# EAGLE design RoverMux (EAGLE 6.4)
DATABASE: /home/mes/eagle/PARTSDB.txt
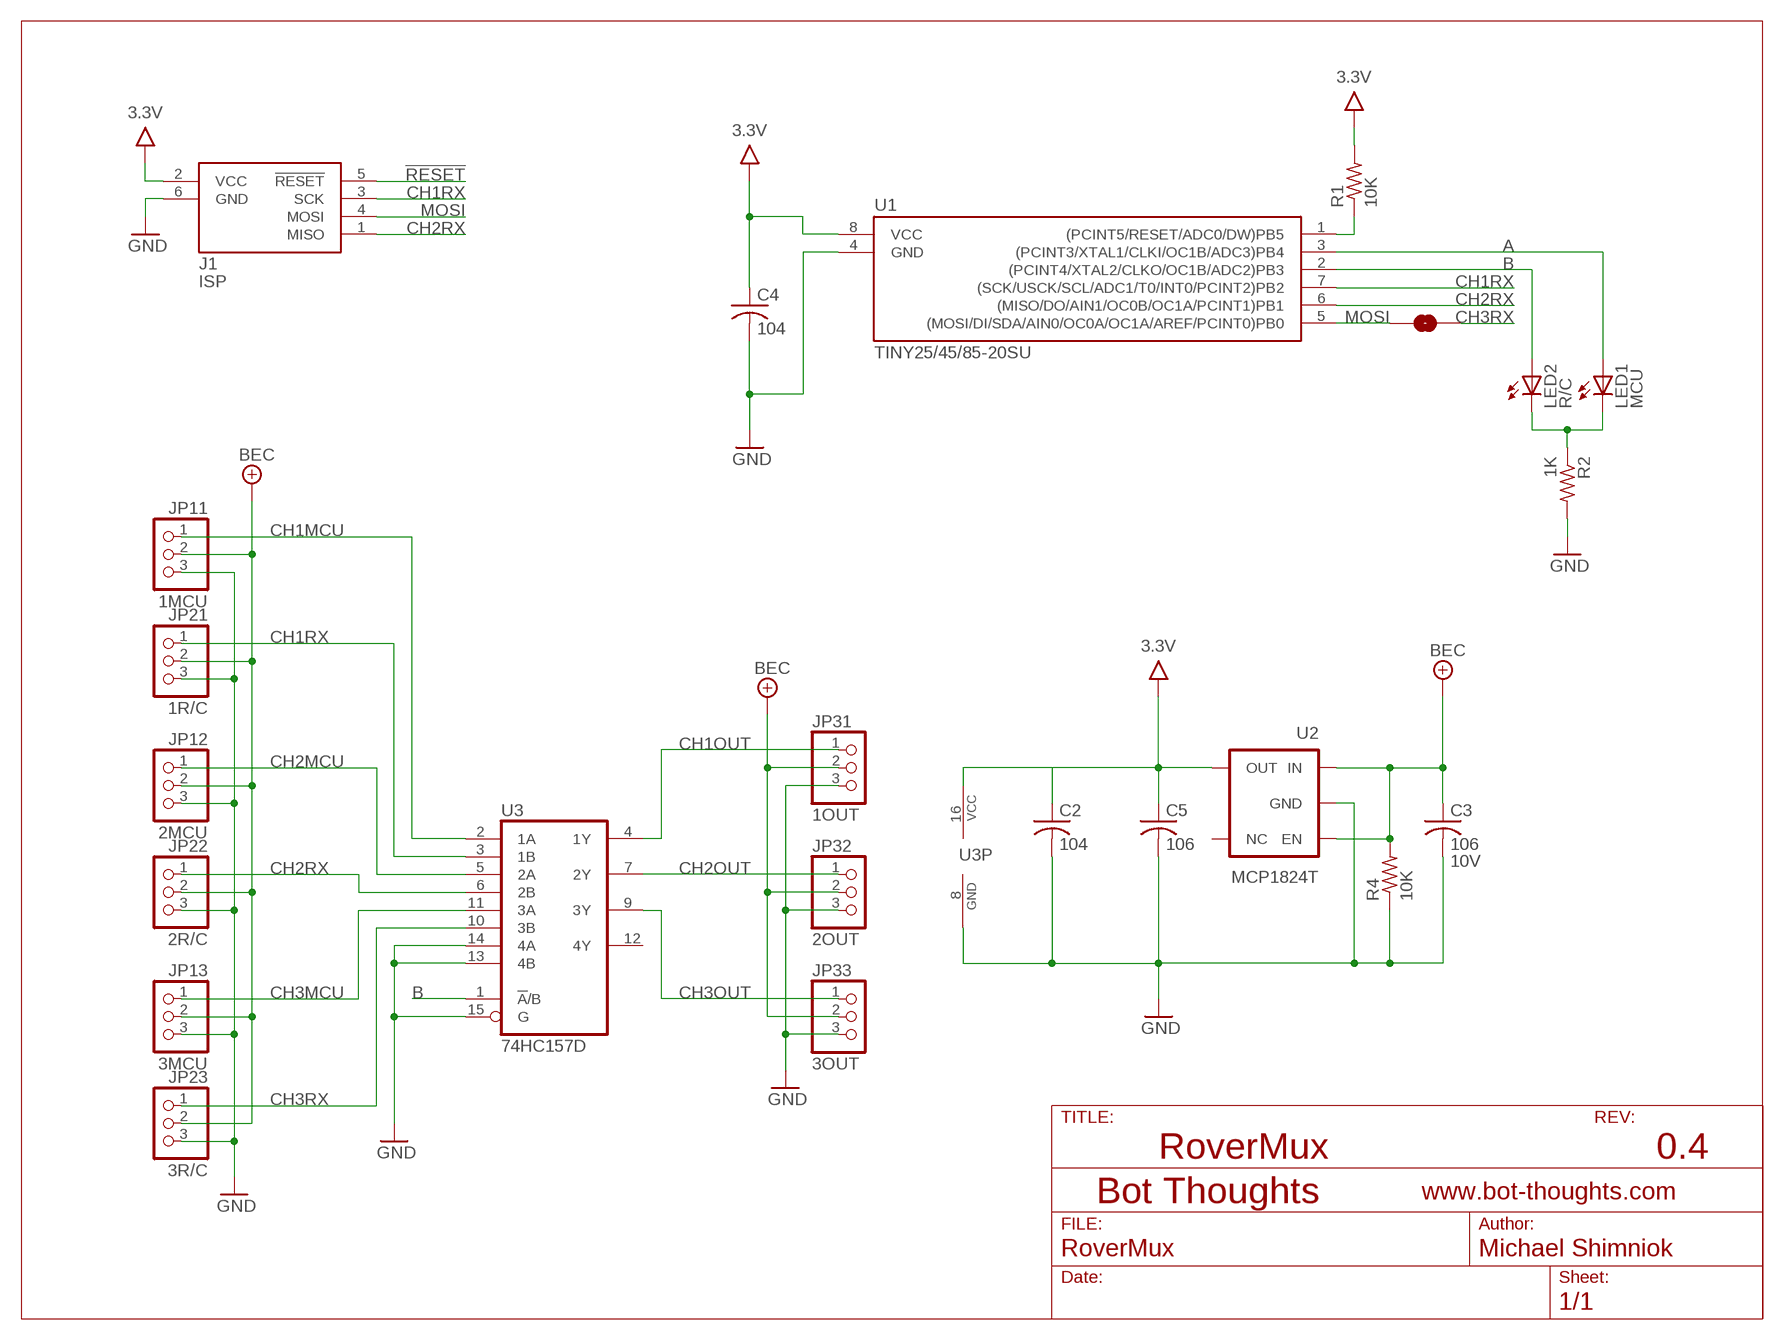
[diagram p0: schematic, sheet 1]

## Parts
C2  104  C-USC0603  [C0603]
C3  106  C-USC0603  [C0603]
C4  104  C-USC0603  [C0603]
C5  106  C-USC0603  [C0603]
J1  ISP  AVRISP6  [CON6P2R]
JP11  1MCU  PINHD-1X03_2.54-S  [1X03-S]
JP12  2MCU  PINHD-1X03_2.54-S  [1X03-S]
JP13  3MCU  PINHD-1X03_2.54-S  [1X03-S]
JP21  1R/C  PINHD-1X03_2.54-S  [1X03-S]
JP22  2R/C  PINHD-1X03_2.54-S  [1X03-S]
JP23  3R/C  PINHD-1X03_2.54-S  [1X03-S]
JP31  1OUT  PINHD-1X03_2.54-S  [1X03-S]
JP32  2OUT  PINHD-1X03_2.54-S  [1X03-S]
JP33  3OUT  PINHD-1X03_2.54-S  [1X03-S]
LED1  MCU  LEDCHIPLED_1206  [CHIPLED_1206]
LED2  R/C  LEDCHIPLED_1206  [CHIPLED_1206]
R1  10K  R-US_R0603  [R0603]
R2  1K  R-US_R0603  [R0603]
R4  10K  R-US_R0603  [R0603]
SJ1  CH3  SOLDERJUMPERNC2  [SJ_2S-NOTRACE]
U1  TINY25/45/85-20SU  [SOIC8]
U2  MCP1824T  MCP1801  [SOT23-5]
U3  74HC157D  74LS157D  [SO16]

## Nets
3.3V: C2.1 C4.1 C5.1 J1.2(VCC) R1.2 U1.8(VCC) U2.5(OUT) U3.16(VCC)
!RESET: J1.5(!RESET) R1.1 U1.1((PCINT5/RESET/ADC0/DW)PB5)
A: LED1.A U1.3((PCINT3/XTAL1/CLKI/OC1B/ADC3)PB4)
B: LED2.A U1.2((PCINT4/XTAL2/CLKO/OC1B/ADC2)PB3) U3.1(!A!/B)
BEC: C3.1 JP11.2 JP12.2 JP13.2 JP21.2 JP22.2 JP23.2 JP31.2 JP32.2 JP33.2 R4.2 U2.1(IN) U2.3(EN)
CH1MCU: JP11.1 U3.2(1A)
CH1OUT: JP31.1 U3.4(1Y)
CH1RX: J1.3(SCK) JP21.1 U1.7((SCK/USCK/SCL/ADC1/T0/INT0/PCINT2)PB2) U3.3(1B)
CH2MCU: JP12.1 U3.5(2A)
CH2OUT: JP32.1 U3.7(2Y)
CH2RX: J1.1(MISO) JP22.1 U1.6((MISO/DO/AIN1/OC0B/OC1A/PCINT1)PB1) U3.6(2B)
CH3MCU: JP13.1 U3.11(3A)
CH3OUT: JP33.1 U3.9(3Y)
CH3RX: JP23.1 SJ1.2 U3.10(3B)
GND: C2.2 C3.2 C4.2 C5.2 J1.6(GND) JP11.3 JP12.3 JP13.3 JP21.3 JP22.3 JP23.3 JP31.3 JP32.3 JP33.3 R2.2 R4.1 U1.4(GND) U2.2(GND) U3.8(GND) U3.13(4B) U3.14(4A) U3.15(G)
MOSI: J1.4(MOSI) SJ1.1 U1.5((MOSI/DI/SDA/AIN0/OC0A/OC1A/AREF/PCINT0)PB0)
N$3: LED1.C LED2.C R2.1
Unconnected: U2.4(NC) U3.12(4Y)

## Notes on the sheet
- RoverMux | 0.4

## Library data of the parts
C2 C4 = rcl:C-US: CAPACITOR, American symbol; PARTNO: C1608X7R1E104K080AA
C3 = rcl:C-US: CAPACITOR, American symbol; PARTNO: CL10A106MP8NNNC; VOLTAGE: 10V
C5 = rcl:C-US: CAPACITOR, American symbol; PARTNO: CL10A106MP8NNNC
J1 = bt_avr:AVRISP6: 6-pin dual-row connector for Atmel AVRISP programmer interface
JP11-JP13 JP21-JP23 JP31-JP33 = pinhead-2:PINHD-1X03: PIN HEADER
LED1 = led:LED: LED OSRAM: - CHIPLED LG R971, LG N971, LY N971, LG Q971, LY Q971, LO R971, LY R971 LH N974, LH R974 LS Q976, LO Q976, LY Q976 LO Q996 - Hyper CHIPLED LW Q18S LB Q993, LB Q99A, LB R99A - SideLED LS A670, LO A670, LY A670, LG A670, LP A670 LB A673, LV A673, LT A673, LW A673 LH A674 LY A675 LS A676, LA A676, LO A676, LY A676, LW A676 LS A679, LY A679, LG A679 - Hyper Micro SIDELED® LS Y876, LA Y876, LO Y876, LY Y876 LT Y87S - SmartLED LW L88C, LW L88S LB L89C, LB L89S, LG L890 LS L89K, LO L89K, LY L89K LS L896, LA L896, LO L896, LY L896 - TOPLED LS T670, LO T670, LY T670, LG T670, LP T670 LSG T670, LSP T670, LSY T670, LOP T670, LYG T670 LG T671, LOG T671, LSG T671 LB T673, LV T673, LT T673, LW T673 LH T674 LS T676, LA T676, LO T676, LY T676, LB T676, LH T676, LSB T676, LW T676 LB T67C, LV T67C, LT T67C, LS T67K, LO T67K, LY T67K, LW E67C LS E67B, LA E67B, LO E67B, LY E67B, LB E67C, LV E67C, LT E67C LW T67C LS T679, LY T679, LG T679 LS T770, LO T770, LY T770, LG T770, LP T770 LB T773, LV T773, LT T773, LW T773 LH T774 LS E675, LA E675, LY E675, LS T675 LS T776, LA T776, LO T776, LY T776, LB T776 LHGB T686 LT T68C, LB T68C - Hyper Mini TOPLED® LB M676 - Mini TOPLED Santana® LG M470 LS M47K, LO M47K, LY M47K Source: http://www.osram.convergy.de LUXEON: - LUMILED® LXK2-PW12-R00, LXK2-PW12-S00, LXK2-PW14-U00, LXK2-PW14-V00 LXK2-PM12-R00, LXK2-PM12-S00, LXK2-PM14-U00 LXK2-PE12-Q00, LXK2-PE12-R00, LXK2-PE12-S00, LXK2-PE14-T00, LXK2-PE14-U00 LXK2-PB12-K00, LXK2-PB12-L00, LXK2-PB12-M00, LXK2-PB14-N00, LXK2-PB14-P00, LXK2-PB14-Q00 LXK2-PR12-L00, LXK2-PR12-M00, LXK2-PR14-Q00, LXK2-PR14-R00 LXK2-PD12-Q00, LXK2-PD12-R00, LXK2-PD12-S00 LXK2-PH12-R00, LXK2-PH12-S00 LXK2-PL12-P00, LXK2-PL12-Q00, LXK2-PL12-R00 Source: www.luxeon.com KINGBRIGHT: KA-3528ASYC Source: www.kingbright.com; PARTNO: LH N974-KN-1
LED2 = led:LED: LED OSRAM: - CHIPLED LG R971, LG N971, LY N971, LG Q971, LY Q971, LO R971, LY R971 LH N974, LH R974 LS Q976, LO Q976, LY Q976 LO Q996 - Hyper CHIPLED LW Q18S LB Q993, LB Q99A, LB R99A - SideLED LS A670, LO A670, LY A670, LG A670, LP A670 LB A673, LV A673, LT A673, LW A673 LH A674 LY A675 LS A676, LA A676, LO A676, LY A676, LW A676 LS A679, LY A679, LG A679 - Hyper Micro SIDELED® LS Y876, LA Y876, LO Y876, LY Y876 LT Y87S - SmartLED LW L88C, LW L88S LB L89C, LB L89S, LG L890 LS L89K, LO L89K, LY L89K LS L896, LA L896, LO L896, LY L896 - TOPLED LS T670, LO T670, LY T670, LG T670, LP T670 LSG T670, LSP T670, LSY T670, LOP T670, LYG T670 LG T671, LOG T671, LSG T671 LB T673, LV T673, LT T673, LW T673 LH T674 LS T676, LA T676, LO T676, LY T676, LB T676, LH T676, LSB T676, LW T676 LB T67C, LV T67C, LT T67C, LS T67K, LO T67K, LY T67K, LW E67C LS E67B, LA E67B, LO E67B, LY E67B, LB E67C, LV E67C, LT E67C LW T67C LS T679, LY T679, LG T679 LS T770, LO T770, LY T770, LG T770, LP T770 LB T773, LV T773, LT T773, LW T773 LH T774 LS E675, LA E675, LY E675, LS T675 LS T776, LA T776, LO T776, LY T776, LB T776 LHGB T686 LT T68C, LB T68C - Hyper Mini TOPLED® LB M676 - Mini TOPLED Santana® LG M470 LS M47K, LO M47K, LY M47K Source: http://www.osram.convergy.de LUXEON: - LUMILED® LXK2-PW12-R00, LXK2-PW12-S00, LXK2-PW14-U00, LXK2-PW14-V00 LXK2-PM12-R00, LXK2-PM12-S00, LXK2-PM14-U00 LXK2-PE12-Q00, LXK2-PE12-R00, LXK2-PE12-S00, LXK2-PE14-T00, LXK2-PE14-U00 LXK2-PB12-K00, LXK2-PB12-L00, LXK2-PB12-M00, LXK2-PB14-N00, LXK2-PB14-P00, LXK2-PB14-Q00 LXK2-PR12-L00, LXK2-PR12-M00, LXK2-PR14-Q00, LXK2-PR14-R00 LXK2-PD12-Q00, LXK2-PD12-R00, LXK2-PD12-S00 LXK2-PH12-R00, LXK2-PH12-S00 LXK2-PL12-P00, LXK2-PL12-Q00, LXK2-PL12-R00 Source: www.luxeon.com KINGBRIGHT: KA-3528ASYC Source: www.kingbright.com; PARTNO: LG N971-KN-1
R1 R4 = rcl:R-US_: RESISTOR, American symbol; PARTNO: 1622829-1
R2 = rcl:R-US_: RESISTOR, American symbol; PARTNO: RC0603JR-07330RL
SJ1 = SparkFun:SOLDERJUMPER: Solder Jumper Standard SMD solder jumper. Used to automate production. Two varients : Normally Open and Normally Closed are the same, but have different paste layers. NC will have a large amount of paste and should jumper during reflow.
U1 = bt_avr:TINY25/45/85: Atmel AVR ATiny25,45,85 8-bit Microcontroller
U2 = mes_regulators:MCP1801: Microchip MCP1801 LDO Regulator The MCP1801 is a family of CMOS low dropout (LDO) voltage regulators that can deliver up to 150 mA of current while consuming only 25 μA of quiescent current (typical) with input operating range from 2.0V to 10.0V. Datasheet.pdf <http://ww1.microchip.com/downloads/en/DeviceDoc/22051D.pdf>; PARTNO: MCP1824T-5002E/OT
U3 = 74xx-us:74*157: Quadruple 2-line to 1-line data SELECTOR/MULTIPLEXER; PARTNO: 74HCT157D,652

## Board
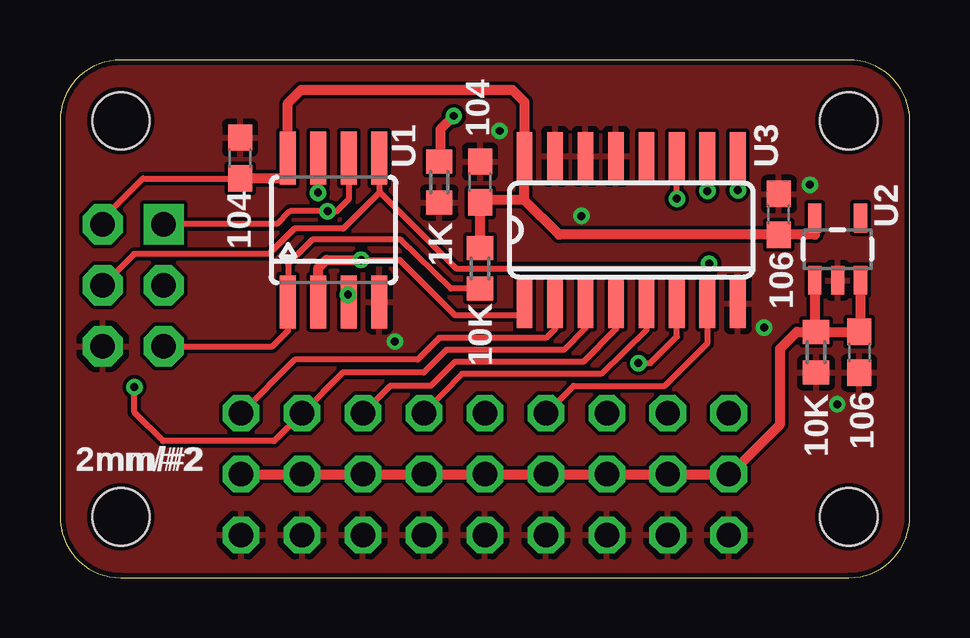
[diagram p1: board, top side]
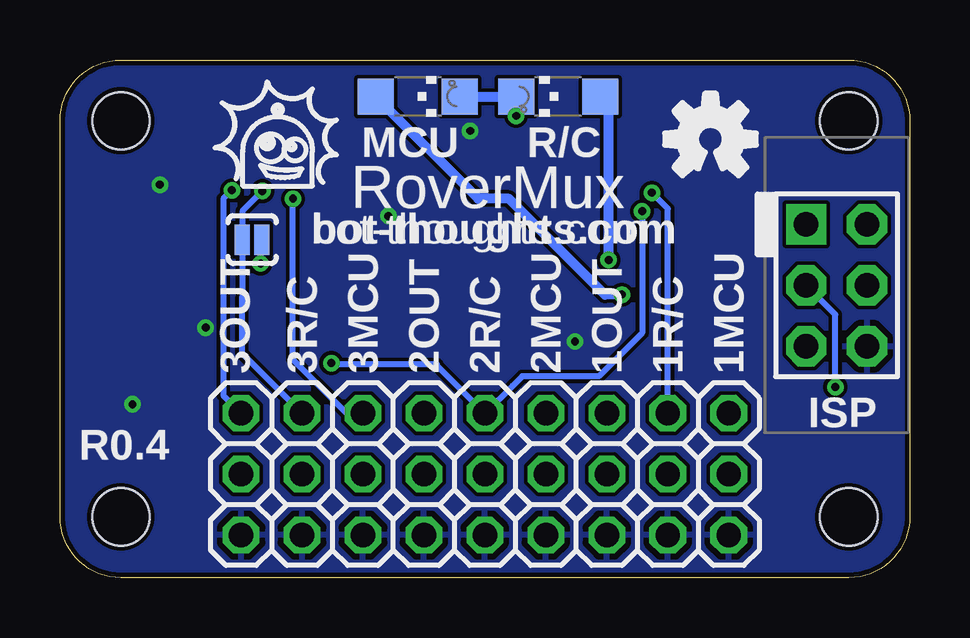
[diagram p2: board, bottom side, seen from below]

Size 35.41 x 21.59 mm. Coordinates in mm from the lower left corner, seen from the top.
Outline: 32.87,21.59 2.54,21.59 arc90 0,19.05 0,2.54 arc90 2.54,0 32.87,0 arc90 35.41,2.54 35.41,19.05 arc90 32.87,21.59
Copper layers (1*16): Top 0.0356mm / dielectric 1.5011mm / Bottom 0.0356mm
Design rules "LaenPCBOrder *": minimum track width 6mil, minimum drill 13mil, track to track 6mil, track to pad 6mil, pad to pad 6mil, via to via 6mil, smd to smd 6mil, copper to edge 8mil, drill to drill 6mil, minimum pad ring 7mil, minimum via ring 7mil, stop-mask expansion 4mil, vias tented up to drill 20mil, thermal gap 10mil
Holes 2.39 mm at 32.87,2.54 32.87,19.05 2.54,2.54 2.54,19.05

### Footprints (pad centres in the part's own frame; a part is rotated, then mirrored left to right if it is on the bottom)
C0603 = smd 1.1 x 1: 1 -0.85,0; 2 0.85,0
CON6P2R = drill 1.016 pad 1.676 square: 1 -2.54,-1.27 | drill 1.016 pad 1.676 octagon: 2 -2.54,1.27; 3 0,-1.27; 4 0,1.27; 5 2.54,-1.27; 6 2.54,1.27
1X03-S = drill 1.016 octagon: 1 -2.54,0; 2 0,0; 3 2.54,0
CHIPLED_1206 = smd 1.5 x 1.5: A 0,-1.75; C 0,1.75
R0603 = smd 1 x 1.1: 1 -0.85,0; 2 0.85,0
SJ_2S-NOTRACE = smd 0.635 x 1.27: 1 -0.401,0; 2 0.413,0
SOIC8 = smd 0.66 x 2.2: 1 -1.905,-3; 2 -0.635,-3; 3 0.635,-3; 4 1.905,-3; 5 1.905,3; 6 0.635,3; 7 -0.635,3; 8 -1.905,3
SOT23-5 = smd 0.55 x 1.2: 1 -0.95,-1.3; 2 0,-1.3; 3 0.95,-1.3; 4 0.95,1.3; 5 -0.95,1.3
SO16 = smd 0.66 x 2.032: 1 -4.445,-3.073; 2 -3.175,-3.073; 3 -1.905,-3.073; 4 -0.635,-3.073; 5 0.635,-3.073; 6 1.905,-3.073; 7 3.175,-3.073; 8 4.445,-3.073; 9 4.445,3.073; 10 3.175,3.073; 11 1.905,3.073; 12 0.635,3.073; 13 -0.635,3.073; 14 -1.905,3.073; 15 -3.175,3.073; 16 -4.445,3.073

### Placement (x,y rotation side)
C2  17.5,16.5 90 top
C3  33.3,9.4 270 top
C4  7.5,17.5 90 top
C5  29.95,15.15 90 top
J1  3.05,12.19 270 bottom
JP11  7.54,4.32 270 bottom
JP12  15.16,4.32 270 bottom
JP13  22.78,4.32 270 bottom
JP21  10.08,4.32 270 bottom
JP22  17.7,4.32 270 bottom
JP23  25.32,4.32 270 bottom
JP31  12.62,4.32 270 bottom
JP32  20.24,4.32 270 bottom
JP33  27.86,4.32 270 bottom
LED1  20.5,20.07 270 bottom
LED2  14.66,20.07 90 bottom
R1  17.5,12.9 90 top
R2  15.8,16.5 270 top
R4  31.5,9.4 90 top
SJ1  27.4,14.1 180 bottom
U1  11.4,14.5 0 top
U2  32.4,13.7 0 top
U3  23.8,14.5 0 top

### Tracks (layer width: path | path; a pad name or v marks a point on that pad's centre or on a via)
3.3V
  Top 0.254: J1.2 1.78,14.98 3.45,16.65 C4.1
  Top 0.406: U2.5 31.45,14.3 C5.1 20.8,14.3 19.35,15.75 | 19.35,15.75 19.35,17.15 19.36,16.86 U3.16 19.35,19.85 18.85,20.35 10.05,20.35 9.49,19.8 U1.8 9.49,16.7 9.4,16.65 C4.1 | 19.35,15.75 17.8,15.75 C2.1 R1.2
!RESET
  Top 0.254: J1.5 8.85,9.65 9.5,10.3 U1.1 9.5,13.1 10.5,14.1 14.2,14.1 16.3,12.05 R1.1
A  (via drill 0.33)
  Top 0.254: U1.3 12.04,11.79 v12,11.8
  Bottom 0.406: v12,11.8 12.7,11.8 16.7,15.8 17.98,15.8 LED1.A
B  (via drill 0.33)
  Top 0.254: v12.55,13.25 14.15,13.25 16.45,10.95 19.25,10.95 19.3,10.9 19.3,11.37 U3.1
  Top 0.406: U1.2 10.77,12.91 11.1,13.25 v12.55,13.25
  Bottom 0.406: v12.55,13.25 12.55,19.71 LED2.A
BEC
  Top 0.254: 31.27,10.18 R4.2 | 33.17,10.18 C3.1
  Top 0.406: R4.2 C3.1 33.35,10.4 U2.3 | U2.1 31.45,10.5 R4.2 | JP11.2 JP21.2 JP31.2 JP12.2 JP22.2 JP32.2 JP13.2 JP23.2 JP33.2 27.92,4.32 30,6.4 30,9.55 30.7,10.25 R4.2
CH1MCU
  Top 0.254: U3.2 20.62,10.38 20.25,10 15.8,10 14.9,9.1 9.79,9.1 JP11.1
CH1OUT
  Top 0.254: U3.4 23.16,10.37 21.8,9 16.45,9 15.45,8 13.77,8 JP31.1
CH1RX  (via drill 0.33)
  Top 0.254: v3.1,7.95 3.1,6.9 4.3,5.7 8.93,5.7 JP21.1 11.78,8.55 15.15,8.55 16.1,9.5 21,9.5 21.89,10.39 U3.3 | U1.7 10.77,16.07 v10.75,16.05
  Bottom 0.254: v3.1,7.95 3.1,10.97 J1.3 | JP21.1 10.08,15.38 v10.75,16.05
CH2MCU
  Top 0.254: U3.5 24.43,10.34 22.55,8.5 16.76,8.5 JP12.1
CH2OUT
  Top 0.254: JP32.1 20.26,6.86 21.4,8 25.2,8 26.98,9.78 U3.7
CH2RX  (via drill 0.33)
  Top 0.254: v24.1,8.95 24.6,8.95 25.7,10.05 25.7,11.4 U3.6 | U1.6 12.05,17.48 12.05,15.8 11.53,15.28 v11.15,15.28 9.58,15.28 9.05,14.75 4.34,14.75 J1.1
  Bottom 0.254: 19.75,8.9 JP22.1 16.55,8 16.15,8.4 12.95,8.4 11.15,10.2 v11.15,15.28 | 19.75,8.9 24.05,8.9 v24.1,8.95 | 19.75,8.9 19.7,8.9
CH3MCU  (via drill 0.33)
  Top 0.254: v25.7,15.8 25.7,17.55 U3.11
  Bottom 0.254: JP13.1 23.46,6.86 25.7,9.1 v25.7,15.8
CH3OUT  (via drill 0.33)
  Top 0.254: U3.9 v28.25,16.16
  Bottom 0.254: v28.25,16.16 28.6,15.8 28.6,7.59 JP33.1
CH3RX  (via drill 0.33)
  Top 0.254: U3.10 v26.98,16.12
  Bottom 0.254: JP23.1 27.83,9.36 SJ1.2 27.81,15.29 v26.98,16.12
GND  (via drill 0.33)
  other vias: 31.25,16.38 32.39,7.23 21.72,15.08 29.34,10.43 13.95,9.85 18.32,18.63
  pour Top (rank 3): 2.54,21.59 32.87,21.59 arc-90 35.41,19.05 35.41,2.54 arc-90 32.87,0 2.54,0 arc-90 0,2.54 0,19.05 arc-90
  pour Bottom: 2.54,21.59 32.87,21.59 arc-90 35.41,19.05 35.41,2.54 arc-90 32.87,0 2.54,0 arc-90 0,2.54 0,19.05 arc-90
MOSI  (via drill 0.33)
  Top 0.254: U1.5 13.3,16.09 | 13.3,16.09 16.5,12.9 26.85,12.9 v27.05,13.1 | 13.3,16.09 13.3,16.05 11.8,14.55 9.75,14.55 8.7,13.5 3.09,13.5 J1.4
  Bottom 0.254: v27.05,13.1 27.05,14.05 SJ1.1
N$3  (via drill 0.33)
  Top 0.406: v16.41,19.26 15.85,18.7 15.85,17.4 R2.1
  Bottom 0.406: LED1.C LED2.C v16.41,19.26

### Text on the board
tPlace: 2mm/#2
bNames: RoverMux | bot-thoughts.com | R0.4
tsilk: U1 | U3 | 104 | 104 | 1K | U2 | 106 | 10K | 10K | 106 | 2mm/#2
bsilk: R/C | MCU | RoverMux | bot-thoughts.com | 1MCU | 1R/C | 1OUT | 2MCU | 2R/C | 2OUT | 3MCU | 3R/C | 3OUT | ISP | R0.4